# EAGLE design weightScale (EAGLE 9.6.2)
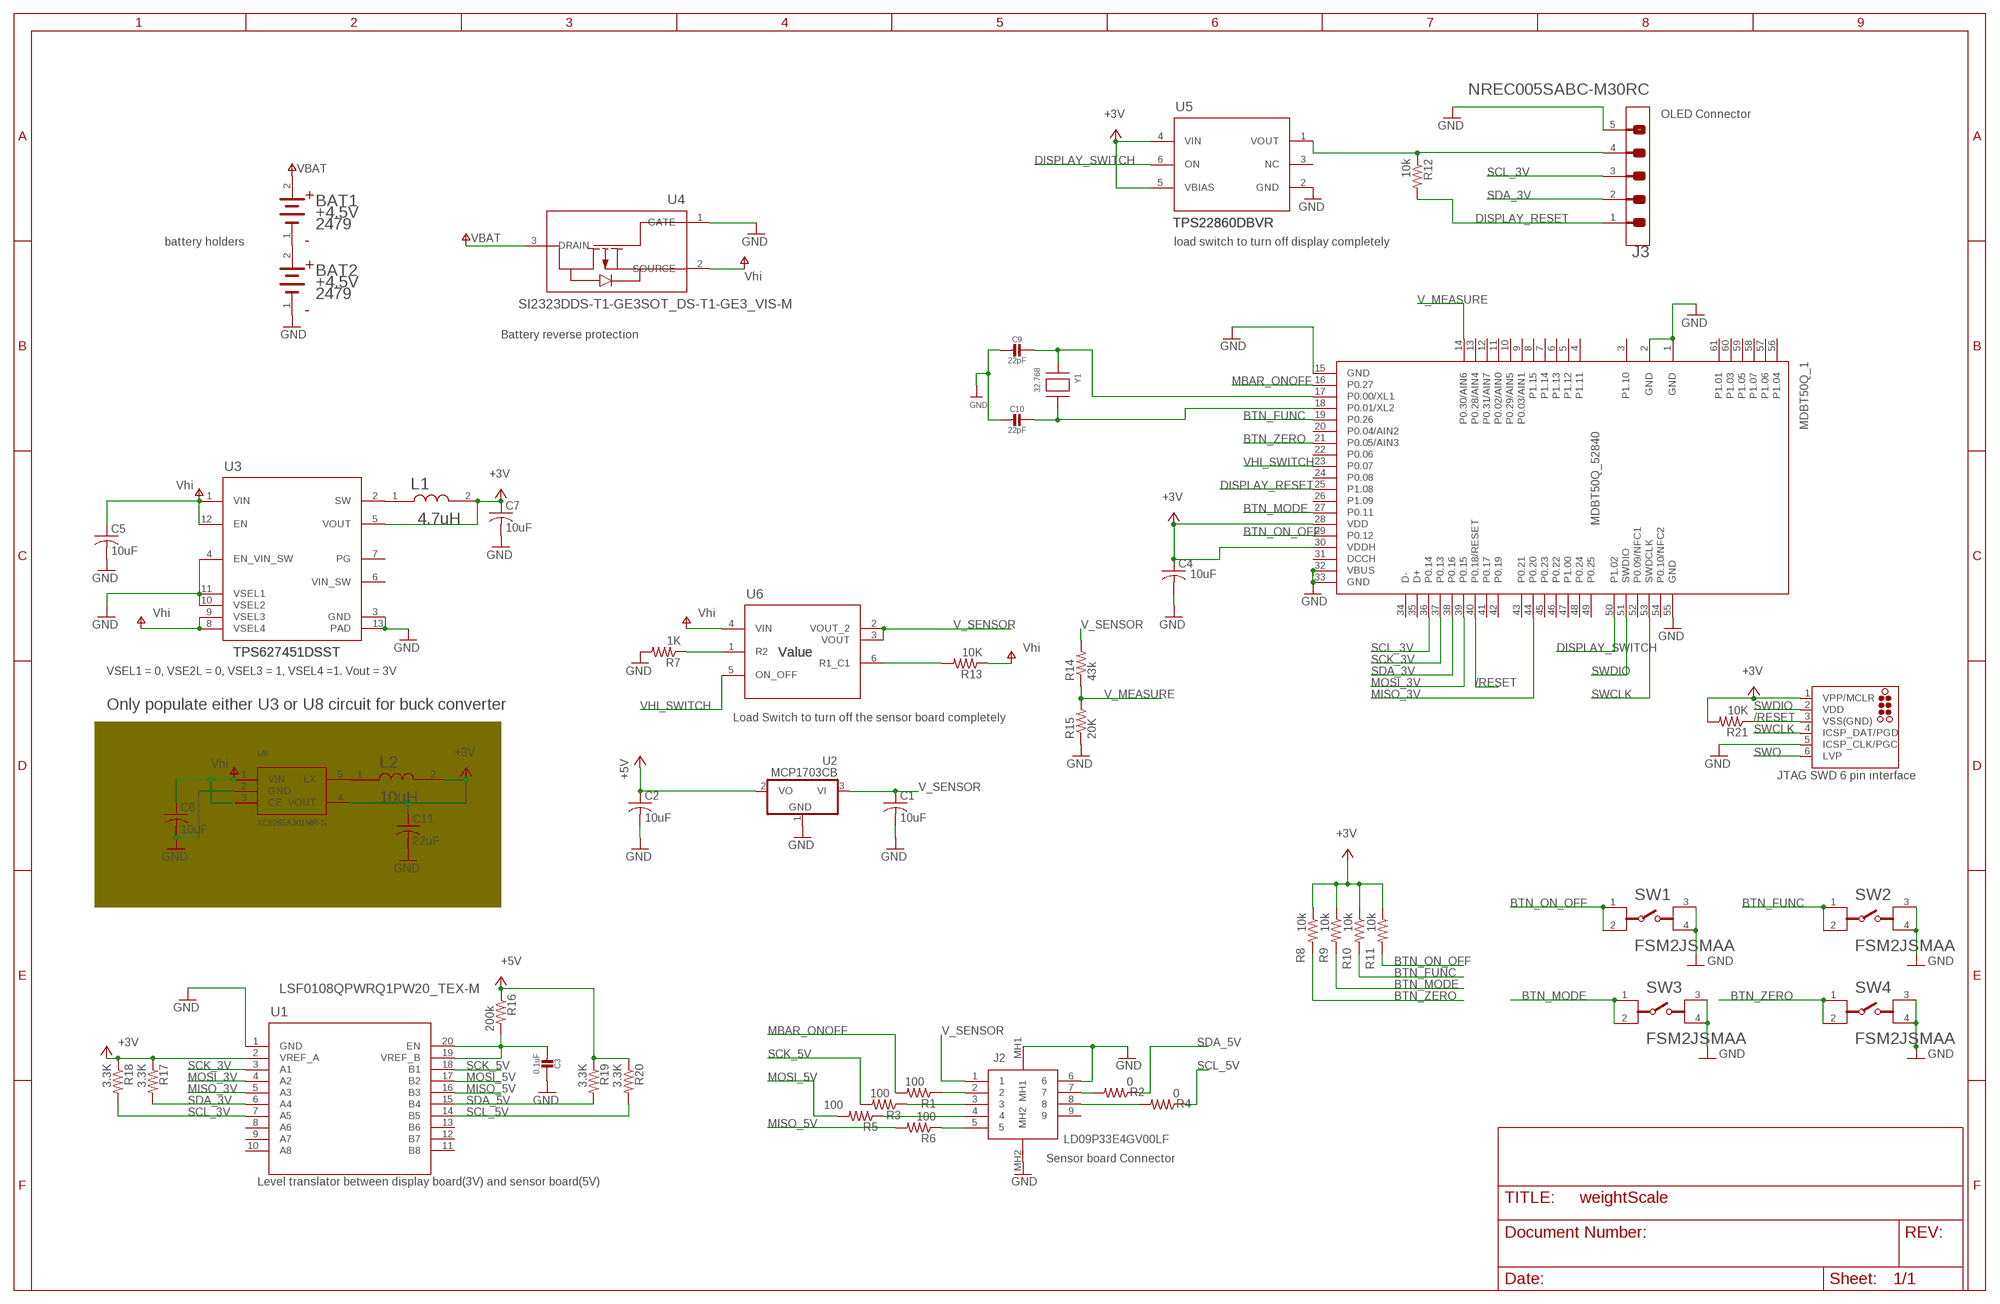
[diagram p0: schematic, sheet 1]

## Parts
BAT1  KEYSTONE_2479KEYSTONE_2479_0_0  [KEYSTONE_2479_0]
BAT2  KEYSTONE_2479KEYSTONE_2479_0_0  [KEYSTONE_2479_0]
C1  10uF  C-USC0805  [C0805]
C2  10uF  C-USC0805  [C0805]
C3  0.1uF  CAP_CERAMIC_0603MP  [_0603MP]
C4  10uF  C-USC1206  [C1206]
C5  10uF  C-USC0805  [C0805]
C6  10uF  C-USC0603K  [C0603K]
C7  10uF  C-USC0805  [C0805]
C9  22pF  CAP_CERAMIC_0603MP  [_0603MP]
C10  22pF  CAP_CERAMIC_0603MP  [_0603MP]
C11  22uF  C-USC0603K  [C0603K]
J2  LD09P33E4GV00LF  [LD09P33E4GV00LF]
J3  SULLINS_NREC005SABC-M30RCSULLINS_NREC005SABC-M30RC_0_0  [SULLINS_NREC005SABC-M30RC_0]
J4  TC2030-MCP-NL  [TC2030-MCP-NL]
L1  MURATA_DFE252010F-4R7M=P2MURATA_DFE252010F-4R7M=P2_0_0  [MURATA_DFE252010F-4R7M=P2_0]
L2  MURATA_1239AS-H-100M=P2MURATA_1239AS-H-100M=P2_0_0  [MURATA_1239AS-H-100M=P2_0]
MDBT50Q_1  MDBT50Q_52840  [MDBT50Q]
R1  100  R-US_R0603  [R0603]
R2  0  R-US_R0603  [R0603]
R3  100  R-US_R0603  [R0603]
R4  0  R-US_R0603  [R0603]
R5  100  R-US_R0603  [R0603]
R6  100  R-US_R0603  [R0603]
R7  1K  R-US_R0603  [R0603]
R8  10k  R-US_R0603  [R0603]
R9  10k  R-US_R0603  [R0603]
R10  10k  R-US_R0603  [R0603]
R11  10k  R-US_R0603  [R0603]
R12  10k  R-US_R0603  [R0603]
R13  10K  R-US_R0603  [R0603]
R14  43k  R-US_R0603  [R0603]
R15  20K  R-US_R0603  [R0603]
R16  200k  R-US_R0603  [R0603]
R17  3.3K  R-US_R0603  [R0603]
R18  3.3K  R-US_R0603  [R0603]
R19  3.3K  R-US_R0603  [R0603]
R20  3.3K  R-US_R0603  [R0603]
R21  10K  R-US_R0603  [R0603]
SW1  TE_CONNECTIVITY_FSM2JSMAATE_CONNECTIVITY_FSM2JSMAA_0_0  [TE_CONNECTIVITY_FSM2JSMAA_0]
SW2  TE_CONNECTIVITY_FSM2JSMAATE_CONNECTIVITY_FSM2JSMAA_0_0  [TE_CONNECTIVITY_FSM2JSMAA_0]
SW3  TE_CONNECTIVITY_FSM2JSMAATE_CONNECTIVITY_FSM2JSMAA_0_0  [TE_CONNECTIVITY_FSM2JSMAA_0]
SW4  TE_CONNECTIVITY_FSM2JSMAATE_CONNECTIVITY_FSM2JSMAA_0_0  [TE_CONNECTIVITY_FSM2JSMAA_0]
U1  LSF0108QPWRQ1PW20_TEX-M  [PW20_TEX-M]
U2  MCP1703CB  [SOT23]
U3  TPS627451DSST  [DSS0012A]
U4  SI2323DDS-T1-GE3SOT_DS-T1-GE3_VIS-M  [SOT_DS-T1-GE3_VIS-M]
U5  TPS22860DBVR  [DBV0006A_N]
U6  Value  TPS27081ADDCR  [DDC0006A_N]
U8  XC9265A301MR-G  [SOT-25]
Y1  32.768  XTAL-3.2X1.5  [XTAL3215]

## Nets
+3V: C4.1 C7.1 C11.1 J4.1(VPP/MCLR) L1.2 L2.2 MDBT50Q_1.28(VDD) MDBT50Q_1.30(VDDH) R8.1 R9.1 R10.1 R11.1 R17.1 R18.1 R21.2 U1.2(VREF_A) U3.5(VOUT) U5.4(VIN) U5.5(VBIAS) U8.4(VOUT)
+5V: C2.1 R16.1 R19.1 R20.1 U2.2(VO)
/RESET: J4.3(VSS(GND)) MDBT50Q_1.40(P0.18/RESET) R21.1
BTN_FUNC: MDBT50Q_1.19(P0.26) R10.2 SW2.1 SW2.2
BTN_MODE: MDBT50Q_1.27(P0.11) R9.2 SW3.1 SW3.2
BTN_ON_OFF: MDBT50Q_1.29(P0.12) R11.2 SW1.1 SW1.2
BTN_ZERO: MDBT50Q_1.21(P0.05/AIN3) R8.2 SW4.1 SW4.2
DISPLAY_RESET: J3.1 MDBT50Q_1.25(P1.08) R12.2
DISPLAY_SWITCH: MDBT50Q_1.50(P1.02) U5.6(ON)
GND: BAT2.1(CATHODE) C1.2 C2.2 C3.1 C4.2 C5.2 C6.2 C7.2 C9.2 C10.2 C11.2 J2.6 J2.MH1 J2.MH2 J3.5 J4.5(ICSP_CLK/PGC) MDBT50Q_1.1(GND) MDBT50Q_1.2(GND) MDBT50Q_1.15(GND) MDBT50Q_1.32(VBUS) MDBT50Q_1.33(GND) MDBT50Q_1.55(GND) R7.2 R15.1 SW1.3 SW1.4 SW2.3 SW2.4 SW3.3 SW3.4 SW4.3 SW4.4 U1.1(GND) U2.1(GND) U3.3(GND) U3.4(EN_VIN_SW) U3.10(VSEL2) U3.11(VSEL1) U3.13(PAD) U4.1(GATE) U5.2(GND) U8.2(GND)
MBAR_ONOFF: MDBT50Q_1.16(P0.27) R1.2
MISO_3V: MDBT50Q_1.44(P0.20) U1.5(A3)
MISO_5V: R6.2 U1.16(B3)
MOSI_3V: MDBT50Q_1.39(P0.15) U1.4(A2)
MOSI_5V: R5.2 U1.17(B2)
N$1: R7.1 U6.1(R2)
N$2: J2.2 R1.1
N$3: R13.2 U6.6(R1_C1)
N$4: J2.3 R3.1
N$5: J2.7 R2.2
N$6: C3.2 R16.2 U1.19(VREF_B) U1.20(EN)
N$7: J2.4 R5.1
N$8: J2.5 R6.1
N$9: C9.1 MDBT50Q_1.17(P0.00/XL1) Y1.P$1
N$10: C10.1 MDBT50Q_1.18(P0.01/XL2) Y1.P$2
N$11: J2.8 R4.2
N$12: J3.4 R12.1 U5.1(VOUT)
N$15: L2.1 U8.5(LX)
N$16: BAT1.1(CATHODE) BAT2.2(ANODE)
N$18: L1.1 U3.2(SW)
SCK_3V: MDBT50Q_1.37(P0.13) U1.3(A1)
SCK_5V: R3.2 U1.18(B1)
SCL_3V: J3.3 MDBT50Q_1.36(P0.14) R18.2 U1.7(A5)
SCL_5V: R4.1 R20.2 U1.14(B5)
SDA_3V: J3.2 MDBT50Q_1.38(P0.16) R17.2 U1.6(A4)
SDA_5V: R2.1 R19.2 U1.15(B4)
SWCLK: J4.4(ICSP_DAT/PGD) MDBT50Q_1.53(SWDCLK)
SWDIO: J4.2(VDD) MDBT50Q_1.51(SWDIO)
SWO: J4.6(LVP)
V+: BAT1.2(ANODE) C5.1 C6.1 R13.1 U3.1(VIN) U3.8(VSEL4) U3.9(VSEL3) U3.12(EN) U4.2(SOURCE) U4.3(DRAIN) U6.4(VIN) U8.1(VIN) U8.3(CE) ; supply symbol labelled Vhi, VBAT
V_MEASURE: MDBT50Q_1.14(P0.30/AIN6) R14.1 R15.2
V_SENSOR: C1.1 J2.1 R14.2 U2.3(VI) U6.2(VOUT_2) U6.3(VOUT)
VHI_SWITCH: MDBT50Q_1.23(P0.07) U6.5(ON_OFF)
Unconnected: J2.9 MDBT50Q_1.3(P1.10) MDBT50Q_1.4(P1.11) MDBT50Q_1.5(P1.12) MDBT50Q_1.6(P1.13) MDBT50Q_1.7(P1.14) MDBT50Q_1.8(P1.15) MDBT50Q_1.9(P0.03/AIN1) MDBT50Q_1.10(P0.29/AIN5) MDBT50Q_1.11(P0.02/AIN0) MDBT50Q_1.12(P0.31/AIN7) MDBT50Q_1.13(P0.28/AIN4) MDBT50Q_1.20(P0.04/AIN2) MDBT50Q_1.22(P0.06) MDBT50Q_1.24(P0.08) MDBT50Q_1.26(P1.09) MDBT50Q_1.31(DCCH) MDBT50Q_1.34(D-) MDBT50Q_1.35(D+) MDBT50Q_1.41(P0.17) MDBT50Q_1.42(P0.19) MDBT50Q_1.43(P0.21) MDBT50Q_1.45(P0.23) MDBT50Q_1.46(P0.22) MDBT50Q_1.47(P1.00) MDBT50Q_1.48(P0.24) MDBT50Q_1.49(P0.25) MDBT50Q_1.52(P0.09/NFC1) MDBT50Q_1.54(P0.10/NFC2) MDBT50Q_1.56(P1.04) MDBT50Q_1.57(P1.06) MDBT50Q_1.58(P1.07) MDBT50Q_1.59(P1.05) MDBT50Q_1.60(P1.03) MDBT50Q_1.61(P1.01) U1.8(A6) U1.9(A7) U1.10(A8) U1.11(B8) U1.12(B7) U1.13(B6) U3.7(PG) U5.3(NC)

## Notes on the sheet
- OLED Connector
- battery holders | load switch to turn off display completely
- Battery reverse protection
- VSEL1 = 0, VSE2L = 0, VSEL3 = 1, VSEL4 =1. Vout = 3V
- Only populate either U3 or U8 circuit for buck converter
- Load Switch to turn off the sensor board completely
- JTAG SWD 6 pin interface
- Sensor board Connector
- Level translator between display board(3V) and sensor board(5V)

## Power pins joined to a net without a drawn wire
VIN_SW: U3.6(VIN_SW)

## Library data of the parts
BAT1 BAT2 = Keystone - 2479:KEYSTONE_2479: PC BATTERY HOLDER (3) 'AAA'; CENTROID_NOT_SPECIFIED: No; DATASHEET: http://www.keyelco.com/product-pdf.cfm?p=1041; DIGIKEY_DESCRIPTION: UNK HOLDER BATTERY 3CELL AAA PC MNT; DIGIKEY_PART_NUMBER: 36-2479-ND; LEAD_FREE: yes; MF: Keystone; MOUNTING_TYPE: PCB, Through Hole; MOUSER_PART_NUMBER: 534-2479; MPN: 2479; PACKAGE: CONN_BAT_HOLDER_3_AAA; PREFIX: BAT; ROHS: yes
C1 C2 C4-C7 C11 = adafruit:C-US: CAPACITOR, American symbol
C3 C9 C10 = microbuilder:CAP_CERAMIC: Ceramic Capacitors For new designs, use the packages preceded by an '_' character since they are more reliable: The following footprints should be used on most boards: _0402 - Standard footprint for regular board layouts _0603 - Standard footprint for regular board layouts _0805 - Standard footprint for regular board layouts _1206 - Standard footprint for regular board layouts For extremely tight-pitch boards where space is at a premium, the following 'micro-pitch' footprints can be used (smaller pads, no silkscreen outline, etc.): _0402MP - Micro-pitch footprint for very dense/compact boards _0603MP - Micro-pitch footprint for very dense/compact boards _0805MP - Micro-pitch footprint for very dense/compact boards _1206MP - Micro-pitch footprint for very dense/compact boards
J2 = SamacSys_Parts:LD09P33E4GV00LF: D-Sub Standard Connectors DSub R/A STB 9 Pin LF Source: Datasheet <https://www.mouser.mx/datasheet/2/18/10130914-1362388.pdf>; ARROW_PART_NUMBER: LD09P33E4GV00LF; ARROW_PRICE-STOCK: https://www.arrow.com/en/products/ld09p33e4gv00lf/amphenol-fci; DESCRIPTION: D-Sub Standard Connectors DSub R/A STB 9 Pin LF; HEIGHT: 12.96mm; MANUFACTURER_NAME: Amphenol; MANUFACTURER_PART_NUMBER: LD09P33E4GV00LF; MOUSER_PART_NUMBER: 649-LD09P33E4GV00LF; MOUSER_PRICE-STOCK: https://www.mouser.co.uk/ProductDetail/Amphenol-FCI/LD09P33E4GV00LF?qs=tZOhSuJQg1nNyHdnl62Ffg%3D%3D
J3 = Sullins - NREC005SABC-M30RC:SULLINS_NREC005SABC-M30RC: HEADER MALE .100"[2.54mm]PITCH, SM; CENTROID_NOT_SPECIFIED: No; DATASHEET: http://media.digikey.com/PDF/Data%20Sheets/Sullins%20PDFs/xRxCzzzSzzz-M30RC_11657-B.pdf; DIGIKEY_DESCRIPTION: CONN S1013EC-05-ND; DIGIKEY_PART_NUMBER: CONN HEADER .100" SNGL SMD 5POS; LEAD_FREE: yes; MF: Sullins; MPN: NREC005SABC-M30RC; PACKAGE: HDR5; PREFIX: J; ROHS: yes; TEMPERATURE_RANGE_HIGH: +105°C; TEMPERATURE_RANGE_LOW: -40°C
J4 = tag-connect:TC2030: TAG-CONNECT ICSP Connector Manufacturer: Tag-Connect <http://www.tag-connect.com> Cable for easy In-Circuit Serial Programming. Designed for Microchip ICD2, suitable for many others. Two variants - one "with legs" (for hands-free fit on PCB) and another "without legs" for quick programming. PAD Description 1 MCLR/Vpp 2 Vdd 3 GND 4 PGD (ISPDAT) 5 PGC (ISPCLK) 6 nc (used for LVP) ©2009 ROFA.cz - modified and updated by Robert Darlington ‹rdarlington@gmail.com›
L1 = Murata - DFE252010F-4R7M=P2:MURATA_DFE252010F-4R7M=P2: Shielded Wirewound Inductor 4.7uH 1400mA 0.24Ω 1008 (2520); AUTOMOTIVE: No; CENTROID_NOT_SPECIFIED: No; COMPOSITION: Wirewound; CORE_MATERIAL: Metal Alloy; DATASHEET: https://www.murata.com/en-us/products/productdetail?partno=DFE252010F-4R7M%23; DEVICE_CLASS_L1: Passive Components; DEVICE_CLASS_L2: Inductors; DEVICE_CLASS_L3: Fixed Inductors; FOOTPRINT_PARAMETERS_1: {"fp_type":"chip_res","params":{"L":{"nom":2500000,"long name":"Length","min":2300000,"max":2700000,"short name":"L","type":"measurement"},"W":{"nom":2000000,"long name":"Width","min":1800000,"max":2200000,"short name":"W","type":"measurement"},"t":{"nom":false,"long name":"Height","min":false,"max":1000000,"short name":"t","type":"measurement"},"b":{"nom":600000,"long name":"Terminal width","min":399999,"max":800000,"short name":"b","type":"measurement"},"P":{"default":"false","long name":"Polarized","type":"multichoice","short name":"P"},"offset x":{"nom":0,"long name":"X Center offset","min":null,"max":null,"short name":"offset x","type":"measurement"},"offset y":{"nom":0,"long name":"Y Center offset","min":null,"max":null,"short name":"offset y","type":"measurement"},"LS":{"long name":"Land shape","type":"fixed","short name":"LS","value":"Rectangle"},"solder toe":{"nom":550000,"long name":"Solder fillet (toe)","min":null,"max":null,"short name":"solder toe","type":"fixedmeasurement"},"solder heel":{"nom":0,"long name":"Solder fillet (heel)","min":null,"max":null,"short name":"solder heel","type":"fixedmeasurement"},"solder side":{"nom":50000,"long name":"Solder fillet (side)","min":null,"max":null,"short name":"solder side","type":"fixedmeasurement"},"courtyard":{"nom":500000,"long name":"Courtyard","min":null,"max":null,"short name":"courtyard","type":"fixedmeasurement"},"SF":{"default":"A (>= 1608 metric)","long name":"Packing level","type":"multichoiceparent","short name":"SF","help":"http://support.upverter.com/customer/portal/articles/978783-what-is-a-footprint-packing-level","children":["solder toe","solder heel","solder side","courtyard"]}}}; FOOTPRINT_PARAMETERS_2: {"fp_type":"chip_res","params":{"L":{"nom":2500000,"long name":"Length","min":2300000,"max":2700000,"short name":"L","type":"measurement"},"W":{"nom":2000000,"long name":"Width","min":1800000,"max":2200000,"short name":"W","type":"measurement"},"t":{"nom":false,"long name":"Height","min":false,"max":1000000,"short name":"t","type":"measurement"},"b":{"nom":600000,"long name":"Terminal width","min":399999,"max":800000,"short name":"b","type":"measurement"},"P":{"default":"false","long name":"Polarized","type":"multichoice","short name":"P"},"offset x":{"nom":0,"long name":"X Center offset","min":null,"max":null,"short name":"offset x","type":"measurement"},"offset y":{"nom":0,"long name":"Y Center offset","min":null,"max":null,"short name":"offset y","type":"measurement"},"LS":{"long name":"Land shape","type":"fixed","short name":"LS","value":"Rectangle"},"solder toe":{"nom":350000,"long name":"Solder fillet (toe)","min":null,"max":null,"short name":"solder toe","type":"fixedmeasurement"},"solder heel":{"nom":0,"long name":"Solder fillet (heel)","min":null,"max":null,"short name":"solder heel","type":"fixedmeasurement"},"solder side":{"nom":0,"long name":"Solder fillet (side)","min":null,"max":null,"short name":"solder side","type":"fixedmeasurement"},"courtyard":{"nom":250000,"long name":"Courtyard","min":null,"max":null,"short name":"courtyard","type":"fixedmeasurement"},"SF":{"default":"B (>= 1608 metric)","long name":"Packing level","type":"multichoiceparent","short name":"SF","help":"http://support.upverter.com/customer/portal/articles/978783-what-is-a-footprint-packing-level","children":["solder toe","solder heel","solder side","courtyard"]}}}; FOOTPRINT_PARAMETERS_3: {"fp_type":"chip_res","params":{"L":{"nom":2500000,"long name":"Length","min":2300000,"max":2700000,"short name":"L","type":"measurement"},"W":{"nom":2000000,"long name":"Width","min":1800000,"max":2200000,"short name":"W","type":"measurement"},"t":{"nom":false,"long name":"Height","min":false,"max":1000000,"short name":"t","type":"measurement"},"b":{"nom":600000,"long name":"Terminal width","min":399999,"max":800000,"short name":"b","type":"measurement"},"P":{"default":"false","long name":"Polarized","type":"multichoice","short name":"P"},"offset x":{"nom":0,"long name":"X Center offset","min":null,"max":null,"short name":"offset x","type":"measurement"},"offset y":{"nom":0,"long name":"Y Center offset","min":null,"max":null,"short name":"offset y","type":"measurement"},"LS":{"long name":"Land shape","type":"fixed","short name":"LS","value":"Rectangle"},"solder toe":{"nom":150000,"long name":"Solder fillet (toe)","min":null,"max":null,"short name":"solder toe","type":"fixedmeasurement"},"solder heel":{"nom":0,"long name":"Solder fillet (heel)","min":null,"max":null,"short name":"solder heel","type":"fixedmeasurement"},"solder side":{"nom":-50000,"long name":"Solder fillet (side)","min":null,"max":null,"short name":"solder side","type":"fixedmeasurement"},"courtyard":{"nom":100000,"long name":"Courtyard","min":null,"max":null,"short name":"courtyard","type":"fixedmeasurement"},"SF":{"default":"C (>= 1608 metric)","long name":"Packing level","type":"multichoiceparent","short name":"SF","help":"http://support.upverter.com/customer/portal/articles/978783-what-is-a-footprint-packing-level","children":["solder toe","solder heel","solder side","courtyard"]}}}; FOOTPRINT_VARIANT_NAME_0: Recommended_Land_Pattern; FOOTPRINT_VARIANT_NAME_1: IPC_A; FOOTPRINT_VARIANT_NAME_2: IPC_B; FOOTPRINT_VARIANT_NAME_3: IPC_C; HEIGHT: 1mm; INDUCTANCE: 4.7uH; IPC_LAND_PATTERN_NAME: CAPC250200X100; LEAD_FREE: Yes; MF: Murata; MFG_PACKAGE_IDENT: DFE252010C; MFG_PACKAGE_IDENT_COMPONENT_ID: f176bbc934fc0607; MFG_PACKAGE_IDENT_DATE: 0; MFG_PACKAGE_IDENT_REV: 0; MPN: DFE252010F-4R7M=P2; PACKAGE: 1008 (2520); PREFIX: L; RMS_CURRENT: 1400mA; ROHS: Yes; SATURATION_CURRENT: 1900mA; SERIES_RESISTANCE: 0.24Ω; SHIELDING: true; TEMPERATURE_RANGE_HIGH: +125°C; TEMPERATURE_RANGE_LOW: -40°C; TEST_FREQUENCY: 1MHz; TOLERANCE: 0.2; VERIFICATION_VERSION: 0.0.0.3
L2 = Murata - 1239AS-H-100M=P2:MURATA_1239AS-H-100M=P2: Shielded Wirewound Inductor 10uH 20% 850mA 0.46Ω 1008 (2520); AUTOMOTIVE: No; CENTROID_NOT_SPECIFIED: No; COMPOSITION: Wirewound; CORE_MATERIAL: Metal Alloy; DATASHEET: https://www.murata.com/en-us/products/productdetail?partno=1239AS-H-100M%23; DEVICE_CLASS_L1: Passive Components; DEVICE_CLASS_L2: Inductors; DEVICE_CLASS_L3: Fixed Inductors; DIGIKEY_DESCRIPTION: FIXED IND 10UH 1A 460 MOHM SMD; DIGIKEY_PART_NUMBER: 490-10563-1-ND; FOOTPRINT_PARAMETERS_1: {"fp_type":"chip_cap","params":{"L":{"nom":2500000,"long name":"Length","min":2300000,"max":2700000,"short name":"L","type":"measurement"},"W":{"nom":2000000,"long name":"Width","min":1800000,"max":2200000,"short name":"W","type":"measurement"},"t":{"nom":false,"long name":"Height","min":false,"max":1200000,"short name":"t","type":"measurement"},"b":{"nom":600000,"long name":"Terminal width","min":400000,"max":800000,"short name":"b","type":"measurement"},"P":{"default":"false","long name":"Polarized","type":"multichoice","short name":"P"},"offset x":{"nom":0,"long name":"X Center offset","min":null,"max":null,"short name":"offset x","type":"measurement"},"offset y":{"nom":0,"long name":"Y Center offset","min":null,"max":null,"short name":"offset y","type":"measurement"},"POL":{"default":"No","long name":"Pin 1 polarity marker","type":"multichoice","short name":"POL"},"LS":{"long name":"Land shape","type":"fixed","short name":"LS","value":"Rectangle"},"solder toe":{"nom":550000,"long name":"Solder fillet (toe)","min":null,"max":null,"short name":"solder toe","type":"fixedmeasurement"},"solder heel":{"nom":0,"long name":"Solder fillet (heel)","min":null,"max":null,"short name":"solder heel","type":"fixedmeasurement"},"solder side":{"nom":50000,"long name":"Solder fillet (side)","min":null,"max":null,"short name":"solder side","type":"fixedmeasurement"},"courtyard":{"nom":500000,"long name":"Courtyard","min":null,"max":null,"short name":"courtyard","type":"fixedmeasurement"},"SF":{"default":"A (>= 1608 metric)","long name":"Packing level","type":"multichoiceparent","short name":"SF","help":"http://support.upverter.com/customer/portal/articles/978783-what-is-a-footprint-packing-level","children":["solder toe","solder heel","solder side","courtyard"]}}}; FOOTPRINT_PARAMETERS_2: {"fp_type":"chip_cap","params":{"L":{"nom":2500000,"long name":"Length","min":2300000,"max":2700000,"short name":"L","type":"measurement"},"W":{"nom":2000000,"long name":"Width","min":1800000,"max":2200000,"short name":"W","type":"measurement"},"t":{"nom":false,"long name":"Height","min":false,"max":1200000,"short name":"t","type":"measurement"},"b":{"nom":600000,"long name":"Terminal width","min":400000,"max":800000,"short name":"b","type":"measurement"},"P":{"default":"false","long name":"Polarized","type":"multichoice","short name":"P"},"offset x":{"nom":0,"long name":"X Center offset","min":null,"max":null,"short name":"offset x","type":"measurement"},"offset y":{"nom":0,"long name":"Y Center offset","min":null,"max":null,"short name":"offset y","type":"measurement"},"POL":{"default":"No","long name":"Pin 1 polarity marker","type":"multichoice","short name":"POL"},"LS":{"long name":"Land shape","type":"fixed","short name":"LS","value":"Rectangle"},"solder toe":{"nom":350000,"long name":"Solder fillet (toe)","min":null,"max":null,"short name":"solder toe","type":"fixedmeasurement"},"solder heel":{"nom":0,"long name":"Solder fillet (heel)","min":null,"max":null,"short name":"solder heel","type":"fixedmeasurement"},"solder side":{"nom":0,"long name":"Solder fillet (side)","min":null,"max":null,"short name":"solder side","type":"fixedmeasurement"},"courtyard":{"nom":250000,"long name":"Courtyard","min":null,"max":null,"short name":"courtyard","type":"fixedmeasurement"},"SF":{"default":"B (>= 1608 metric)","long name":"Packing level","type":"multichoiceparent","short name":"SF","help":"http://support.upverter.com/customer/portal/articles/978783-what-is-a-footprint-packing-level","children":["solder toe","solder heel","solder side","courtyard"]}}}; FOOTPRINT_PARAMETERS_3: {"fp_type":"chip_cap","params":{"L":{"nom":2500000,"long name":"Length","min":2300000,"max":2700000,"short name":"L","type":"measurement"},"W":{"nom":2000000,"long name":"Width","min":1800000,"max":2200000,"short name":"W","type":"measurement"},"t":{"nom":false,"long name":"Height","min":false,"max":1200000,"short name":"t","type":"measurement"},"b":{"nom":600000,"long name":"Terminal width","min":400000,"max":800000,"short name":"b","type":"measurement"},"P":{"default":"false","long name":"Polarized","type":"multichoice","short name":"P"},"offset x":{"nom":0,"long name":"X Center offset","min":null,"max":null,"short name":"offset x","type":"measurement"},"offset y":{"nom":0,"long name":"Y Center offset","min":null,"max":null,"short name":"offset y","type":"measurement"},"POL":{"default":"No","long name":"Pin 1 polarity marker","type":"multichoice","short name":"POL"},"LS":{"long name":"Land shape","type":"fixed","short name":"LS","value":"Rectangle"},"solder toe":{"nom":150000,"long name":"Solder fillet (toe)","min":null,"max":null,"short name":"solder toe","type":"fixedmeasurement"},"solder heel":{"nom":0,"long name":"Solder fillet (heel)","min":null,"max":null,"short name":"solder heel","type":"fixedmeasurement"},"solder side":{"nom":-50000,"long name":"Solder fillet (side)","min":null,"max":null,"short name":"solder side","type":"fixedmeasurement"},"courtyard":{"nom":100000,"long name":"Courtyard","min":null,"max":null,"short name":"courtyard","type":"fixedmeasurement"},"SF":{"default":"C (>= 1608 metric)","long name":"Packing level","type":"multichoiceparent","short name":"SF","help":"http://support.upverter.com/customer/portal/articles/978783-what-is-a-footprint-packing-level","children":["solder toe","solder heel","solder side","courtyard"]}}}; FOOTPRINT_VARIANT_NAME_0: Recommended_Land_Pattern; FOOTPRINT_VARIANT_NAME_1: IPC_A; FOOTPRINT_VARIANT_NAME_2: IPC_B; FOOTPRINT_VARIANT_NAME_3: IPC_C; HEIGHT: 1.2mm; INDUCTANCE: 10uH; IPC_LAND_PATTERN_NAME: CAPC250200X120; LEAD_FREE: Yes; MF: Murata; MFG_PACKAGE_IDENT: DFE252012C; MFG_PACKAGE_IDENT_COMPONENT_ID: bc933d2e2fe95b90; MFG_PACKAGE_IDENT_DATE: 0; MFG_PACKAGE_IDENT_REV: 0; MOUSER_DESCRIPTION: Inductor Power Shielded Multi-Layer 10uH 20% 1MHz Metal 850mA 460mOhm DCR 1008 T/R; MOUSER_PART_NUMBER: 81-1239AS-H-100MP2; MPN: 1239AS-H-100M=P2; PACKAGE: 1008 (2520); PREFIX: L; RMS_CURRENT: 850mA; ROHS: Yes; SATURATION_CURRENT: 1000mA; SERIES_RESISTANCE: 0.46Ω; SHIELDING: true; TEMPERATURE_RANGE_HIGH: +85°C; TEMPERATURE_RANGE_LOW: -40°C; TEST_FREQUENCY: 1MHz; TOLERANCE: 20%; VERIFICATION_VERSION: 0.0.0.3
MDBT50Q_1 = MDBT50Q_52840_210702:MDBT50Q_52840: Raytac Corporation Part Number: MDBT50Q-1MV2 / MDBT50Q-P1MV2 / MDBT50Q-U1MV2 Bluetooth Low Energy Module based on Noridc nRF52840 Size: 15.5x10.5mm Source: Raytac datasheet
R1-R21 = adafruit:R-US_: RESISTOR, American symbol
SW1-SW4 = TE Connectivity - FSM2JSMAA:TE_CONNECTIVITY_FSM2JSMAA: SWITCH TACTILE SPST-NO 0.05A 24V; AUTOMOTIVE: No; CENTROID_NOT_SPECIFIED: No; CONTACT_CURRENT_RATING: 50mA; CONTACT_RESISTANCE: 100mΩ; DATASHEET: https://www.te.com/commerce/DocumentDelivery/DDEController?Action=showdoc&DocId=Customer+Drawing%7F2-1437565-7%7FV%7Fpdf%7FEnglish%7FENG_CD_2-1437565-7_V.pdf%7F2-1437565-8; DEVICE_CLASS_L1: Electromechanical; DEVICE_CLASS_L2: Switches; DEVICE_CLASS_L3: Pushbutton Switches; DIGIKEY_DESCRIPTION: SWITCH TACTILE SPST-NO 0.05A 24V; DIGIKEY_PART_NUMBER: 450-3355-ND; ELECTROMECHANICAL_LIFE: 100000Cycles; FOOTPRINT_VARIANT_NAME_0: Recommended_Land_Pattern; HEIGHT: 4.59mm; LEAD_FREE: Yes; MF: TE Connectivity; MFG_PACKAGE_IDENT: 0; MFG_PACKAGE_IDENT_DATE: 0; MFG_PACKAGE_IDENT_REV: 0; MOUNT: Surface Mount; MOUSER_DESCRIPTION: Tactile Switches TACTILE 260G FORCE S; MOUSER_PART_NUMBER: 506-2-1437565-8; MPN: FSM2JSMAA; OPERATING_FORCE: 260gf; PACKAGE: SMT_SW_6MM00_6MM00; PREFIX: SW; ROHS: Yes; STANDOFF_HEIGHT: 0.05mm; TEMPERATURE_RANGE_HIGH: +85°C; TEMPERATURE_RANGE_LOW: -35°C; THROW_CONFIGURATION: SPST-NO; VERIFICATION_VERSION: 0.0.0.3; VOLTAGE_RATING_DC: 24V
U1 = LSF0108:LSF0108QPWRQ1; COPYRIGHT: Copyright (C) 2021 Ultra Librarian. All rights reserved.; MANUFACTURER_PART_NUMBER: LSF0108QPWRQ1; MFR_NAME: Texas Instruments
U2 = linear:MCP1703: 250 mA, 16V, Low Quiescent Current LDO Regulator Source: http://ww1.microchip.com/downloads/en/DeviceDoc/22049b.pdf
U3 = weightScale:TPS627451DSST; COPYRIGHT: Copyright (C) 2021 Ultra Librarian. All rights reserved.; MANUFACTURER_PART_NUMBER: TPS627451DSST; MFR_NAME: Texas Instruments; REFDES: RefDes; TYPE: TYPE
U4 = weightScale:SI2323DDS-T1-GE3; COPYRIGHT: Copyright (C) 2021 Ultra Librarian. All rights reserved.; MANUFACTURER_PART_NUMBER: SI2323DDS-T1-GE3; MFR_NAME: Vishay
U5 = weightScale:TPS22860DBVR; COPYRIGHT: Copyright (C) 2021 Ultra Librarian. All rights reserved.; MANUFACTURER_PART_NUMBER: TPS22860DBVR; MFR_NAME: Texas Instruments; REFDES: RefDes; TYPE: TYPE
U6 = weightScale:TPS27081ADDCR; APPLICATION_BUILDNUMBER: *; COMPTYPE: IC; MANUFACTURER: Texas Instruments; MOUNTTYPE: SMT; PACKAGEREFERENCE: DDC0006A; PARTNUMBER: TPS27081ADDCR; PIN_COUNT: 6; REFDES: RefDes; ROHS: Y; TYPE: TYPE
U8 = weightScale:XC9265A301MR-G: XC9265 series are Ultra Low Power synchronous-rectification type PFM step down DC/DC converters with a built-in 0.4Ω (TYP.) Pch driver and 0.4Ω (TYP.) Nch synchronous switching transistor, designed to allow the use of ceramic capacitor. PFM control enables a low quiescent current, making these products ideal for battery operated devices that require high efficiency and long battery life. Only inductor, CIN and CL capacitors are needed as external parts to make a step down DC/DC circuit. Operation voltage range is from 2.0V to 6.0V. This product has fixed output voltage from 1.0V to 4.0V(accuracy: ±2.0%) in increments of 0.05V.
Y1 = adafruit2:XTAL: Low cost SMT crystals, no capacitors included http://www.ladyada.net/library/eagle

## Board
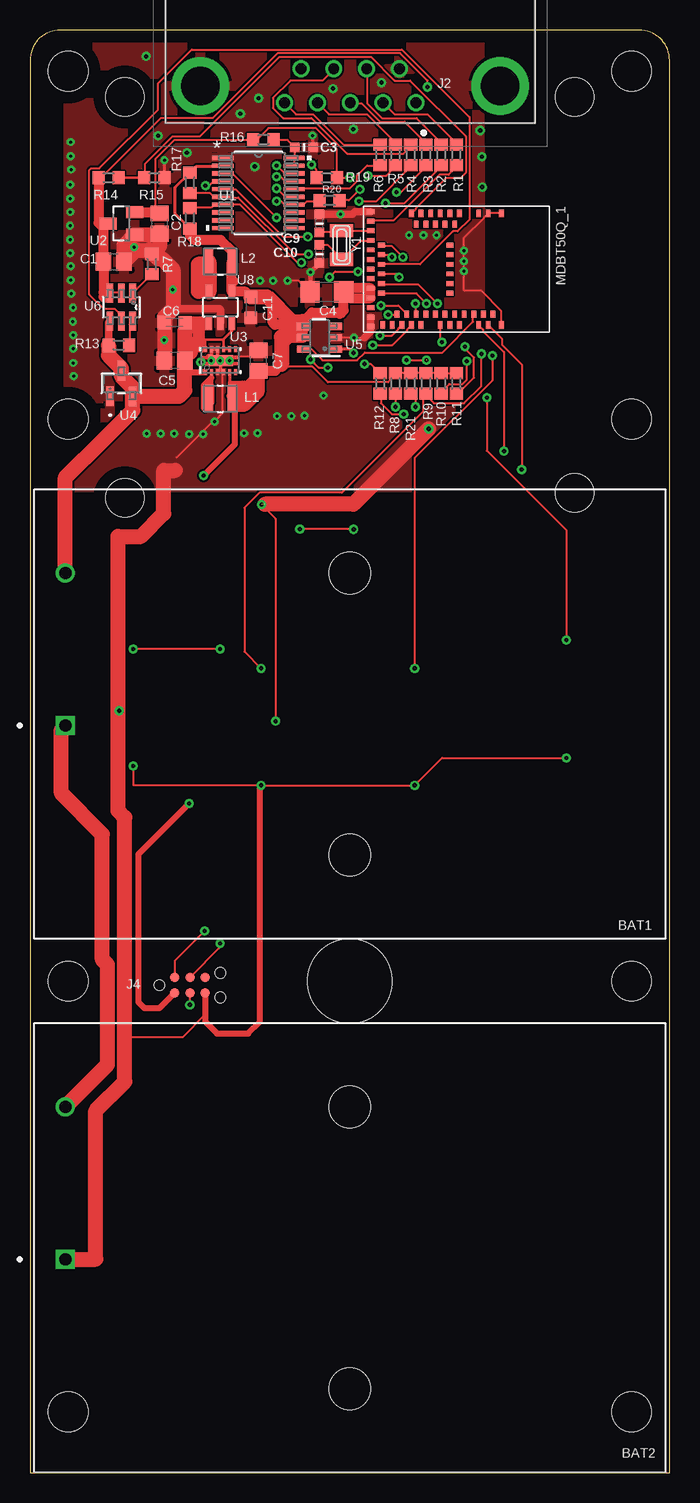
[diagram p1: board, top side]
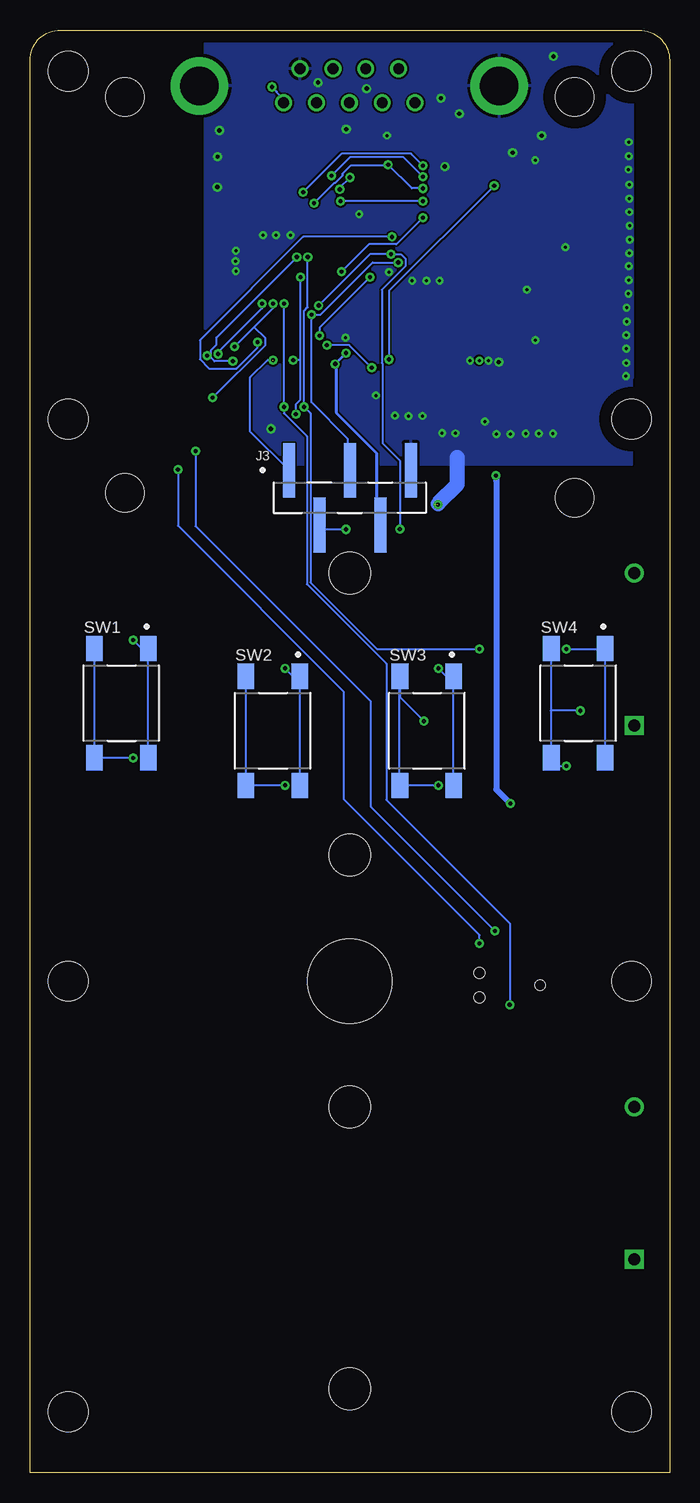
[diagram p2: board, bottom side, seen from below]

Size 53.34 x 120.27 mm. Coordinates in mm from the lower left corner, seen from the top.
Outline: 0,0 53.34,0 53.34,117.73 arc90 50.8,120.27 2.54,120.27 arc90 0,117.73 0,0
Copper layers (1*16): Top 0.035mm / dielectric 1.5mm / Bottom 0.035mm
Design rules "default": minimum track width 6mil, minimum drill 0.35mm, track to track 6mil, track to pad 6mil, pad to pad 6mil, via to via 6mil, smd to smd 6mil, copper to edge 40mil, drill to drill 6mil, minimum pad ring 10mil, minimum via ring 8mil, stop-mask expansion 4mil, vias tented up to drill 0mil, thermal gap 10mil
Holes 3.3 mm at 3.17,5.08 50.16,5.08 3.17,40.97 50.16,40.97 3.17,87.83 50.16,87.83 50.16,116.84 3.17,116.84
Holes 3.17 mm at 7.92,114.68 7.92,81.28 45.42,114.68 45.42,81.69
Holes 7.01 mm at 26.67,40.97

### Footprints (pad centres in the part's own frame; a part is rotated, then mirrored left to right if it is on the bottom)
KEYSTONE_2479_0 = drill 1.02 pad 1.57 square: 1 23.72,0.95 | drill 1.02 pad 1.57: 2 23.72,-11.75 | hole 3.45: 0,11.75; 0,-11.75
C0805 = smd 1.3 x 1.5: 1 -0.85,0; 2 0.85,0
_0603MP = smd 0.8 x 0.8: 1 -0.762,0; 2 0.762,0
C1206 = smd 1.6 x 1.8: 1 -1.4,0; 2 1.4,0
C0603K = smd 1.05 x 1.08: 1 -0.875,0; 2 0.875,0
LD09P33E4GV00LF = drill 0.9 pad 1.4: 1 0,0; 2 2.74,0; 3 5.48,0; 4 8.22,0; 5 10.96,0; 6 1.37,-2.84; 7 4.11,-2.84; 8 6.85,-2.84; 9 9.59,-2.84 | drill 3.2 pad 4.8: MH1 -7.015,-1.42; MH2 17.975,-1.42
SULLINS_NREC005SABC-M30RC_0 = smd 1 x 4.565: 1 -5.08,2.282; 2 -2.54,-2.282; 3 0,2.282; 4 2.54,-2.282; 5 5.08,2.282
TC2030-MCP-NL = smd 0.787 x 0.787: 1 1.27,-0.635; 2 1.27,0.635; 3 2.54,-0.635; 4 2.54,0.635; 5 3.81,-0.635; 6 3.81,0.635 | hole 0.889: 0,0; 5.08,-1.016; 5.08,1.016
MURATA_DFE252010F-4R7M=P2_0 = smd 0.8 x 2: 1 -1,0; 2 1,0
MURATA_1239AS-H-100M=P2_0 = smd 0.8 x 2: 1 -1,0; 2 1,0
MDBT50Q = smd 0.6 x 0.4: 1 -4.65,3.75; 2 -4.65,2.65; 3 -4.65,1.85; 4 -4.65,0.25; 5 -3.75,-0.15; 6 -4.65,-0.55; 7 -3.75,-0.95; 8 -4.65,-1.35; 9 -3.75,-1.75; 10 -4.65,-2.15; 11 -3.75,-2.55; 12 -4.65,-2.95; 13 -3.75,-3.35; 14 -4.65,-3.75; 34 4.65,-6.15; 35 4.65,-5.35; 36 3.75,-4.95; 37 4.65,-4.55; 38 3.75,-4.15; 39 4.65,-3.75; 40 3.75,-3.35; 41 4.65,-2.95; 42 3.75,-2.55; 43 3.75,-1.75; 44 4.65,-1.35; 45 3.75,-0.95; 46 4.65,-0.55; 47 3.75,-0.15; 48 4.65,0.25; 49 3.75,0.65; 50 3.75,1.45; 51 4.65,1.85; 52 3.75,2.25; 53 4.65,2.65; 54 3.75,3.05; 55 4.65,3.75 | smd 0.4 x 0.6: 15 -4.8,-7.15; 16 -4,-7.15; 17 -3.2,-7.15; 18 -2.4,-7.15; 19 -2,-6.25; 20 -1.6,-7.15; 21 -1.2,-6.25; 22 -0.8,-7.15; 23 -0.4,-6.25; 24 0,-7.15; 25 0.4,-6.25; 26 0.8,-7.15; 27 1.2,-6.25; 28 1.6,-7.15; 29 2,-6.25; 30 2.4,-7.15; 31 3.2,-7.15; 32 4,-7.15; 33 4.8,-7.15; 56 -2,-0.55; 57 -1.2,-0.55; 58 -0.4,-0.55; 59 0.4,-0.55; 60 1.2,-0.55; 61 2,-0.55
R0603 = smd 1 x 1.1: 1 -0.85,0; 2 0.85,0
TE_CONNECTIVITY_FSM2JSMAA_0 = smd 1.38 x 2.1: 1 2.25,4.55; 2 2.24,-4.55; 3 -2.24,4.55; 4 -2.24,-4.55
PW20_TEX-M = smd 1.778 x 0.356: 1 -2.972,2.925; 2 -2.972,2.275; 3 -2.972,1.625; 4 -2.972,0.975; 5 -2.972,0.325; 6 -2.972,-0.325; 7 -2.972,-0.975; 8 -2.972,-1.625; 9 -2.972,-2.275; 10 -2.972,-2.925; 11 2.972,-2.925; 12 2.972,-2.275; 13 2.972,-1.625; 14 2.972,-0.975; 15 2.972,-0.325; 16 2.972,0.325; 17 2.972,0.975; 18 2.972,1.625; 19 2.972,2.275; 20 2.972,2.925
SOT23 = smd 1 x 1.4: 1 -0.95,-1.1; 2 0.95,-1.1; 3 0,1.1
DSS0012A = smd 0.5 x 0.25: 1 -0.95,1.25; 2 -0.95,0.75; 3 -0.95,0.25; 4 -0.95,-0.25; 5 -0.95,-0.75; 6 -0.95,-1.25; 7 0.95,-1.25; 8 0.95,-0.75; 9 0.95,-0.25; 10 0.95,0.25; 11 0.95,0.75; 12 0.95,1.25 | smd 0.9 x 2: 13 0,0 | smd 0.5 x 0.5: V 0,0.75; V_ 0,-0.75; V__ 0,0
SOT_DS-T1-GE3_VIS-M = smd 0.61 x 1.626: 1 -0.95,-1.067; 2 0.95,-1.067; 3 0,1.067
DBV0006A_N = smd 1 x 0.6: 1 -1.375,0.95; 2 -1.375,0; 3 -1.375,-0.95; 4 1.375,-0.95; 5 1.375,0; 6 1.375,0.95
DDC0006A_N = smd 1.575 x 0.559: 1 -1.168,0.95; 2 -1.168,0; 3 -1.168,-0.95; 4 1.168,-0.95; 5 1.168,0; 6 1.168,0.95
SOT-25 = smd 0.55 x 1.2: 1 -0.95,-1.3; 2 0,-1.3; 3 0.95,-1.3; 4 0.95,1.3; 5 -0.95,1.3
XTAL3215 = smd 1.1 x 1.9: P$1 1.2,0; P$2 -1.2,0

### Placement (x,y rotation side)
BAT1  26.67,63.25 180 top
BAT2  26.67,18.75 180 top
C1  6.99,100.97 0 top
C2  10.79,104.14 270 top
C3  22.86,110.49 180 top
C4  24.77,98.42 180 top
C5  12.06,92.71 180 top
C6  12.06,95.89 180 top
C7  19.05,92.71 90 top
C9  24.13,104.14 90 top
C10  24.13,101.6 270 top
C11  18.41,97.16 270 top
J2  32.19,114.2 180 top
J3  26.67,81.28 0 bottom
J4  10.79,40.64 0 top
L1  15.88,89.53 0 top
L2  15.88,100.97 0 top
MDBT50Q_1  35.56,100.33 270 top
R1  35.56,109.86 270 top
R2  34.29,109.86 90 top
R3  33.02,109.86 270 top
R4  31.75,109.86 90 top
R5  30.48,109.86 270 top
R6  29.21,109.86 270 top
R7  10.16,100.75 90 top
R8  30.48,90.81 270 top
R9  33.02,90.81 270 top
R10  34.29,90.81 270 top
R11  35.56,90.81 270 top
R12  29.21,90.81 270 top
R13  7.41,93.98 0 top
R14  6.57,107.95 180 top
R15  10.38,107.95 180 top
R16  19.47,111.12 0 top
R17  13.34,107.53 270 top
R18  13.34,104.56 90 top
R19  24.77,107.95 180 top
R20  24.98,106.05 180 top
R21  31.75,90.81 90 top
SW1  45.72,64.16 0 bottom
SW2  33.1,61.85 0 bottom
SW3  20.24,61.85 0 bottom
SW4  7.62,64.16 0 bottom
U1  19.05,106.68 0 top
U2  7.62,104.14 90 top
U3  15.88,92.71 90 top
U4  7.62,90.81 0 top
U5  24.13,94.61 180 top
U6  7.62,97.16 270 top
U8  15.88,97.16 0 top
Y1  25.99,102.35 90 top

### Tracks (layer width: path | path; a pad name or v marks a point on that pad's centre or on a via)
+3V  (via drill 0.35)
  Top 0.152: U1.2 15.62,108.97 15.53,108.9 | R10.1 33.07,91.67 R9.1 32.99,91.67 31.77,91.67 R21.2 31.7,91.67 R8.1 30.48,91.52 29.87,90.91 24.84,90.91 23.55,92.2 21.57,92.2 20.97,92.39 | R10.1 35.51,91.67 R11.1 | R10.1 | v13.27,55.79 13.31,55.83 13.32,55.83
  Top 0.254: 17.86,90.93 16.88,89.95 L1.2 | L1.2 16.88,90.1 17.71,90.93 | L1.2 16.88,90.63 | 17.86,90.93 18.04,90.93 18.16,90.82 | 17.71,90.93 17.86,90.93 | 16.73,90.93 17.71,90.93 | 17.5,90.16 16.95,90.71 | 16.88,90.63 16.88,90.79 | 16.88,90.63 16.95,90.71 | 16.95,90.71 17.36,90.71 17.7,90.36 | 16.95,90.71 16.88,90.79 | 16.88,90.79 16.73,90.93 | 16.73,90.93 16.62,90.93 | 16.62,90.93 16.62,90.44 16.65,90.42 | U3.5 16.62,90.93 | R18.1 12.11,104.94 12.11,107.15 R17.1 13.86,108.9 15.53,108.9
  Top 0.508: 16.62,89.78 L1.2 17.5,90.16 17.7,90.36 18.16,90.82 19.05,91.71 C7.1 | J4.1 10.77,38.71 9.56,38.71 9.06,39.21 9.06,51.57 13.32,55.83 | v14.49,83.12 17.1,85.74 17.1,88.9 17.16,88.96
  Top 0.813: C7.1 20.44,91.86 20.97,92.39 20.97,93.93 21.66,94.61 U5.5 U5.4 | U5.4 22.62,95.7 20.43,95.7 20.24,95.89 20.24,97.64 19.86,98.03 C11.1 17.99,98.45 U8.4 16.82,99.31 | U5.4 22.75,95.97 23.5,96.72 25.73,96.72 25.85,96.6 26.16,96.92 C4.1 | C4.1 26.66,97.93 MDBT50Q_1.30 MDBT50Q_1.28 26.47,98.73 C4.1 | 16.82,99.31 16.82,100.92 L2.2 16.88,101.78 15.9,102.76 13.71,102.76 13.34,103.13 R18.1 | 16.82,99.31 16.99,99.31
  Top 1.016: C7.1 19.05,90.83 | 19.05,90.83 19.05,90.08 17.93,88.96 17.16,88.96 | 19.05,90.83 17.59,89.37
  Top 1.27: 20.97,92.39 20.97,94.67 21.86,95.56 U5.4 | 22.75,95.97 21.82,95.97 19.76,98.03 C11.1
  Bottom 0.152: 14.46,82.67 14.49,82.7 v14.49,83.12
  Bottom 0.508: v13.27,55.79 14.46,56.98 14.46,82.67 14.46,83.13
+5V  (via drill 0.35)
  Top 0.152: v27.51,106.98 26.59,106.07 25.83,106.07 R20.1 | v26.67,107.97 25.68,107.97 R19.1 25.6,107.97 25.6,110.34 23.85,112.09 19.89,112.09 18.97,111.18 18.67,111.18 R16.1 18.59,111.1 12.04,111.1 10.44,109.5 10.44,105.46 C2.1
  Top 0.813: U2.2 10.7,105.09 C2.1
  Bottom 0.152: v27.51,106.98 27.51,107.14 v26.67,107.97
/RESET  (via drill 0.35)
  Top 0.152: v32.16,97.46 32.16,96.62 MDBT50Q_1.40 | v32.16,88.85 32.16,89.53 31.77,89.92 R21.1 | v13.34,39.01 J4.3
  Bottom 0.152: v32.16,97.46 v32.16,88.85 32.16,88.32 30.25,86.41 30.25,74.07 23.62,67.44 23.62,56.08 13.34,45.8 v13.34,39.01
BTN_FUNC  (via drill 0.35)
  Top 0.152: v31.09,101.35 30.18,102.26 29.34,102.26 MDBT50Q_1.19 | v36.42,92.66 36.42,91.14 36.04,90.75 34.98,90.75 34.29,90.07 R10.2 | v32.08,67.06 32.08,84.58 38.56,91.06 v38.56,93.12
  Bottom 0.152: SW2.2 30.86,66.37 SW2.1 30.94,66.37 31.39,66.37 v32.08,67.06 | v31.09,101.35 37.8,94.64 37.8,94.03 38.25,93.57 38.25,93.12 | 38.25,93.12 38.25,92.96 37.95,92.66 v36.42,92.66 | 38.25,93.12 v38.56,93.12
BTN_MODE  (via drill 0.35)
  Top 0.152: v33.98,97.46 32.38,99.06 29.34,99.06 MDBT50Q_1.27 | v37.64,93.27 37.64,90.6 36.2,89.15 33.68,89.15 33.07,89.76 33.07,89.92 R9.2 32.76,89.7 32.76,88.44 26.01,81.69 19.14,81.69 17.89,80.44 17.89,68.44 v19.28,67.06
  Bottom 0.152: SW3.2 18.06,57.3 18.06,66.37 SW3.1 18.14,66.37 18.59,66.37 v19.28,67.06 | v33.98,97.46 33.98,97.08 37.64,93.42 v37.64,93.27
BTN_ON_OFF  (via drill 0.35)
  Top 0.152: v33.07,97.46 32.23,98.3 29.34,98.3 MDBT50Q_1.29 | v36.27,93.88 36.27,93.73 37.03,92.96 37.03,91.29 35.74,89.99 35.59,89.99 R11.2 | v44.73,69.42 44.73,78.56 38.1,85.19 v38.1,89.61
  Bottom 0.152: SW1.2 43.51,59.66 43.51,68.66 SW1.1 43.59,68.66 43.97,68.66 v44.73,69.42 | v33.07,97.46 33.07,97.08 34.63,95.52 | v36.27,93.88 34.63,95.52 | v38.1,89.61 33.76,93.95 33.76,94.64 34.63,95.52
BTN_ZERO  (via drill 0.35)
  Top 0.152: v30.18,101.35 30.02,101.5 29.34,101.5 MDBT50Q_1.21 | R8.2 v30.48,88.85 | v15.85,68.66 v8.61,68.66
  Bottom 0.152: SW4.2 5.41,59.66 5.41,68.66 SW4.1 5.49,68.66 v8.61,68.66 | v30.18,101.35 30.18,97.16 30.48,96.85 v30.48,88.85 29.95,88.32 29.95,74.22 24.38,68.66 v15.85,68.66
DISPLAY_RESET  (via drill 0.35)  (1 unrouted)
  Top 0.152: v30.79,99.67 30.56,99.9 29.34,99.9 MDBT50Q_1.25 | v31.17,88.24 30.18,88.24 29.26,89.15 29.26,89.92 R12.2 | v31.39,92.75 v33.07,92.75
  Bottom 0.152: 30.79,92.72 30.79,89.46 31.17,89.08 v31.17,88.24 | 30.79,92.72 v30.79,99.67 | J3.1 34.97,86.78 34.97,91.31 33.53,92.76 33.12,92.76 | 30.79,92.72 30.82,92.75 v31.39,92.75
DISPLAY_SWITCH
  Top 0.152: MDBT50Q_1.50 36.96,96.55 36.96,95.94 34.4,93.38 27.93,93.38 27.28,92.73 24.38,92.73 23.47,93.65 22.78,93.65 U5.6
GND  (via drill 0.25, 0.35)  (2 unrouted)
  Top 0.152: 16.07,91.76 16.15,91.75 U3.4 16.08,91.67 16.08,88.54 16.13,88.49 v15.4,87.64 15.21,87.64 12.21,84.64 | 15.12,93.19 14.86,93.19 v14.25,92.58 | v8.61,58.9 8.61,57.3 19.18,57.3 v19.28,57.3 v32.08,57.3 34.37,59.59 v44.73,59.59 | J4.5 14.61,38.2 12.71,36.3 8.05,36.3 | 2.97,17.83 BAT2.1 | MDBT50Q_1.55 39.31,96.85 37.64,98.52 36.23,98.52 36.21,98.55 36.21,102.95 37.84,104.58 37.84,104.61 MDBT50Q_1.2 MDBT50Q_1.1 | v16.64,92.71 16.97,93.04 17.04,93.04 | C7.2 18.53,93.04 17.04,93.04 | 23.58,110.53 C3.1 | C10.2 24.13,100.81 | 23.39,99.03 | U3.13 15.88,91.77 15.88,91.76 | 17.04,93.04 17.14,92.94 | 27.91,94.61 27.91,94.62 v27.03,94.62 U5.2 | v23.39,100.07 23.36,100.05 C4.2 22.41,99.38 v21.47,99.38 | v19.32,80.7 20.48,79.54 v20.48,62.65 | 28.42,96.32 MDBT50Q_1.32 28.42,96.32
  Top 0.254: R15.1 11.22,109.48 11.24,109.5 | 15.12,93.38 U3.11 U3.10 | v23.58,111.48 23.58,110.53
  Top 0.305: 15.08,92.84 15.12,92.89 15.12,93.19 15.12,93.38 | U3.10 15.62,93.25 | 15.88,92.16 15.88,92.01 U3.3 15.88,91.76 16.07,91.76
  Top 0.381: 24.13,100.81 v23.39,100.07 23.39,99.03
  Top 0.508: J4.5 14.61,37.61 15.6,36.62 18.2,36.62 19.18,37.6 19.18,57.3
  Top 0.61: 11.92,97.06 15.79,97.06 15.91,96.94 15.91,95.89 U8.2 | C9.2 26.89,104.9 27.11,105.13 MDBT50Q_1.15 | MDBT50Q_1.32 28.41,95.11 27.91,94.61
  Top 1.27: 10.49,101.93 10.79,102.23 C2.2 10.7,103.19 U2.1 7.83,102.31 C1.2 8.8,101.93 9.97,101.93 | 10.49,101.93 R7.2 | 9.97,101.93 10.49,101.93 | 9.97,101.93 10.71,101.19 11.04,101.19 11.92,100.31 11.92,97.06 11.21,96.35 C5.2 | BAT2.1 5.5,17.8 5.5,30.2 7.9,32.6 7.9,54.64 7.34,55.2 7.34,78.04 9.27,78.04 11.16,79.94 11.16,83.54 12.12,83.54 | v33.25,87.02 26.97,80.74 19.58,80.75
  Bottom 0.152: SW1.3 48.01,68.66 48.01,59.66 SW1.4 47.93,59.59 v44.73,59.59 | SW2.3 35.36,66.37 35.36,57.3 SW2.4 35.28,57.3 v32.08,57.3 | 9.91,63.51 9.91,68.66 SW4.3 | 9.91,63.51 9.91,59.66 SW4.4 9.83,59.59 9.14,58.9 v8.61,58.9 | v19.28,57.3 SW3.4 22.55,57.3 22.55,66.37 SW3.3 22.48,64.66 v20.47,62.65 | v7.44,63.52 9.9,63.52 9.91,63.51 | v19.32,80.7 19.32,80.78
  Bottom 1.27: 17.71,84.65 17.71,82.39 19.32,80.78
  other vias: 25.88,104.91 15.12,92.71 8.7,102.15 11.21,94.43 11.91,98.61 11.21,109.43 24.49,89.81 3.63,91.41 3.61,92.51 3.61,93.7 33.91,103.18 32.81,103.16 31.62,103.16 12.01,86.64 10.9,86.61 9.72,86.62 14.45,86.58 13.26,86.58 18.97,86.67 17.86,86.65 22.89,88.12 21.79,88.09 20.6,88.1 19.18,99.36 20.28,99.39 3.61,94.84 3.58,95.95 3.59,97.13 3.43,98.3 3.4,99.41 3.41,100.59 3.36,101.68 3.33,102.78 3.34,103.97 3.37,105.1 3.35,106.2 3.35,107.39 3.43,108.64 3.4,109.74 3.41,110.93 18.75,108.89 13.09,110.03 19.06,114.59 17.54,113.3 26.96,112.01 9.7,118.07 10.68,111.46 25.26,115.39 29.31,115.89 37.54,111.89 37.69,109.72 37.71,107.18 36.17,100.17 36.18,100.99 36.17,101.89
  pour Bottom: 3.09,91.28 3.09,119.5 3.2,119.61 38.75,119.61 38.75,85.5 40.18,84.07 3.14,84.07 3.14,91.55
  pour Top: 37.47,119.49 37.57,84.18 37.57,82.17 37.59,82.14 3.22,82.14 3.22,119.49
MBAR_ONOFF
  Top 0.152: MDBT50Q_1.16 28.42,104.39 30.33,104.39 34.14,108.2 34.9,108.2 35.51,108.81 35.51,108.97 R1.2
MISO_3V  (via drill 0.35)
  Top 0.152: v34.37,94.26 34.21,94.41 34.21,95.63 MDBT50Q_1.44 | v23.16,103.02 21.11,103.02 17.14,106.98 16.08,106.98 U1.5
  Bottom 0.152: v34.37,94.26 34.37,93.8 36.12,92.05 38.41,92.05 39.17,92.81 39.17,94.41 30.56,103.02 v23.16,103.02
MISO_5V
  Top 0.152: R6.2 29.18,108.97 28.12,108.97 27.28,108.13 27.28,107.67 26.67,107.06 22.02,107.06 U1.16
MOSI_3V  (via drill 0.35)
  Top 0.152: v28.58,94.01 30.23,94.01 31.47,95.25 31.47,95.33 31.77,95.63 MDBT50Q_1.39 | v24.84,92.13 24.08,92.13 v23.39,92.81 | v14.63,107.29 14.94,107.29 15.24,107.59 16.08,107.59 U1.4
  Bottom 0.152: v28.58,94.01 26.72,94.01 v24.84,92.13 | v23.39,92.81 23.39,98.53 v14.63,107.29
MOSI_5V  (via drill 0.35)
  Top 0.152: v28.19,108.13 29.72,108.13 30.02,108.43 30.02,108.51 30.48,108.97 R5.2 | v20.57,108.05 20.88,108.05 21.26,107.67 22.02,107.67 U1.17
  Bottom 0.152: v28.19,108.13 26.67,109.65 22.17,109.65 v20.57,108.05
N$1
  Top 0.152: R7.1 10.13,99.9 8.61,98.37 U6.1
N$2
  Top 0.152: R1.1 35.51,110.72 35.51,110.87 33.15,113.23 30.4,113.23 29.49,114.15 J2.2
N$3
  Top 0.152: R13.2 8.31,94.03 8.31,95.71 8.53,95.94 U6.6
N$4
  Top 0.152: R3.1 32.99,110.72 32.99,110.87 31.24,112.62 29.18,112.62 27.66,114.15 26.75,114.15 J2.3
N$5
  Top 0.152: R2.2 34.29,110.87 32.23,112.93 29.34,112.93 28.12,114.15 28.12,116.97 J2.7
N$6
  Top 0.152: R16.2 20.34,111.1 21.49,111.1 C3.2 22.1,109.73 22.02,109.65 U1.20 U1.19
N$7
  Top 0.152: R5.1 30.48,110.87 28.12,113.23 24.92,113.23 24,114.15 J2.4
N$8
  Top 0.152: R6.1 29.18,110.72 26.14,110.72 23.62,113.23 22.17,113.23 21.26,114.15 J2.5
N$9
  Top 0.152: MDBT50Q_1.17 28.35,103.56 26.06,103.56 Y1.P$1 25.98,103.48 25.91,103.4 24.16,103.4 C9.1
N$10
  Top 0.152: MDBT50Q_1.18 28.35,102.72 27.58,102.72 26.06,101.19 Y1.P$2 25.98,101.19 24.84,102.34 24.16,102.34 C10.1
N$11
  Top 0.152: R4.2 31.7,110.64 31.7,110.49 31.17,109.96 26.44,109.96 23.47,112.93 21.11,112.93 20.27,113.77 20.27,114.61 21.72,116.05 24.38,116.05 25.3,116.97 J2.8
N$12  (via drill 0.35)
  Top 0.152: 26.06,93.65 25.53,93.65 U5.1 | v27.89,92.43 28.42,92.43 29.18,91.67 R12.1
  Top 0.254: 26.06,93.65 26.67,93.65 v26.98,93.34
  Bottom 0.152: 27.81,92.43 v27.89,92.43 | 27.81,88.52 27.81,88.38
  Bottom 0.254: v27.89,92.43 v26.98,93.34 | 27.81,92.43 27.81,88.52 27.81,88.39 | 27.81,88.38 24.84,85.41 24.45,85.01 24.45,79.31 J3.4
N$14  (via drill 0.25)
  other vias: 15.87,92.71
N$15
  Top 1.27: U8.5 14.93,100.92 L2.1 14.64,100.73 14.03,100.73 14.03,98.48
N$16
  Top 1.27: BAT2.2 6.48,34.02 6.48,42.34 6.04,42.78 6.04,53.22 2.61,56.65 2.61,61.96 BAT1.1
N$18
  Top 0.152: L1.1 15.12,89.53
  Top 0.203: U3.2 15.12,91.68
  Top 0.254: 15.12,90.61 15.12,91.28 15.12,91.68 | 15.12,90.46 15.12,90.18 15.12,90.17
  Top 0.508: 14.51,90.66 14.51,88.78 14.59,88.7 15.12,89.23 15.12,89.53 15.12,90.46 | 14.51,90.66 14.92,90.66 15.12,90.46 | 15.12,91.28 14.51,90.66 | 15.12,90.46 15.12,90.61
SCK_3V  (via drill 0.35)
  Top 0.152: v29.18,94.79 30.18,94.79 30.71,95.33 30.71,95.4 30.94,95.63 MDBT50Q_1.37 | v20.57,104.62 16.92,108.28 16.08,108.28 U1.3 | v24.97,99.66 25.44,100.13 v27.36,100.13
  Bottom 0.152: v29.18,94.79 29.18,95.45 v24.97,99.66 | v27.36,100.13 25.07,102.41 22.78,102.41 v20.57,104.62
SCK_5V  (via drill 0.35)
  Top 0.152: v30.56,106.76 30.94,106.76 32.99,108.81 32.99,108.97 R3.2 | v20.57,108.97 21.18,108.36 22.02,108.36 U1.18
  Bottom 0.152: v30.56,106.76 27.36,109.96 21.57,109.96 v20.57,108.97
SCL_3V  (via drill 0.35)
  Top 0.152: 16.08,105.69 15.32,105.69 15.09,105.46 13.34,105.46 R18.2 | v29.87,96.55 30.56,96.55 MDBT50Q_1.36 | 16.08,105.69 17.53,105.69 22.33,100.89 v22.63,100.89 | 16.08,105.69 U1.7
  Bottom 0.152: J3.3 26.67,83.59 26.82,83.74 26.82,86.18 29.87,89.23 v29.87,96.55 29.11,96.55 24.77,100.89 v22.63,100.89
SCL_5V  (via drill 0.35)
  Top 0.152: 22.02,105.77 22.86,105.77 23.09,105.99 24.08,105.99 R20.2 | v27.43,105.99 28.88,105.99 31.7,108.81 31.7,108.97 R4.1 | v20.57,105.99 20.95,105.99 21.18,105.77 22.02,105.77 | 22.02,105.77 U1.14
  Bottom 0.152: v20.57,105.99 v27.43,105.99
SDA_3V  (via drill 0.35)  (1 unrouted)
  Top 0.152: v29.26,97.31 30.71,97.31 31.39,96.62 MDBT50Q_1.38 | v23.24,101.58 22.1,101.58 17.37,106.3 16.08,106.3 U1.6 16.08,106.38 15.32,106.38 15.01,106.68 R17.2 | v26.99,78.65 22.54,78.65 22.5,78.68
  Bottom 0.152: v29.26,97.31 24.99,101.58 v23.24,101.58 22.4,101.58 22.02,101.19 22.02,100.58 24,98.6 24,92.51 23.93,92.43 23.93,85.82 22.48,84.36 22.48,78.68 v22.5,78.66 | J3.2 28.86,78.65 v26.99,78.65 26.93,78.65
SDA_5V  (via drill 0.35)
  Top 0.152: v23.47,109.04 23.85,108.66 23.85,107.97 R19.2 | v20.57,107.06 21.26,106.38 22.02,106.38 U1.15 | v29.64,105.84 31.24,105.84 33.83,108.43 33.83,108.51 34.29,108.97 R2.1
  Bottom 0.152: v20.57,107.06 21.49,107.06 v23.47,109.04 23.47,108.97 26.59,108.97 27.28,108.28 27.28,108.13 27.89,107.52 27.96,107.52 v29.64,105.84
SWCLK  (via drill 0.35)
  Top 0.152: v15.85,44.12 15.85,43.81 13.34,41.3 J4.4 | 38.24,95.65 MDBT50Q_1.53 39.37,94.52 39.37,94.02 41,92.39 v41,83.63
  Bottom 0.152: v15.85,44.12 15.85,44.82 27.15,56.13 27.15,65.1 41,78.95 v41,83.63
SWDIO  (via drill 0.35)
  Top 0.152: J4.2 12.06,42.67 v14.56,45.16 | MDBT50Q_1.51 37.78,95.31 37.78,95.18 39.53,93.43 v39.53,85.16
  Bottom 0.152: v14.56,45.16 24.9,55.51 24.91,55.51 24.91,64.28 39.53,78.91 v39.53,85.16
V+
  Top 0.152: U3.1 14.63,91.75 14.48,91.76 | 14.55,93.65 14.4,93.64 | 14.43,95.69 14.86,95.78 U8.1 | 14.62,94.46 U3.12 13.21,93.66
  Top 0.203: 14.62,94.46 14.63,94.46 16.02,94.46 16.08,94.41 16.12,94.36 U3.9 U3.8
  Top 0.254: 16.08,94.41 16.82,95.15 U8.3
  Top 0.508: 13.21,93.66 14.4,93.64 14.4,93.68 | 12.91,91.7 12.98,91.76 14.48,91.76
  Top 0.61: R13.1 6.55,95.87 U6.4
  Top 1.016: 12.91,93.37 13.21,93.66 13.77,94.22 14.09,94.22 14.09,95.53 14.25,95.69 14.43,95.69 14.24,95.89 C6.1
  Top 1.27: BAT1.2 2.95,82.96 4.52,84.53 4.54,84.53 8.57,88.56 U4.2 | U4.2 8.57,90.47 7.62,91.42 U4.3 7.62,92.06 6.55,93.13 R13.1 | U4.2 12.43,89.74 12.91,90.22 12.91,91.7 C5.1 12.91,93.37 12.94,93.39 | 13.36,93.39 12.94,93.39 | 12.94,93.39 12.94,95.18 12.98,95.23
V_MEASURE
  Top 0.152: MDBT50Q_1.14 31.85,105 32.16,105.31 32.16,105.39 34.67,107.9 35.89,107.9 36.35,108.36 36.35,111.4 31.7,116.05 30.4,116.05 28.42,118.03 20.8,118.03 14.17,111.4 11.89,111.4 9.6,109.12 9.6,107.97 R15.2
  Top 0.203: R14.1 R15.2
V_SENSOR  (via drill 0.35)
  Top 0.152: 6.13,98.37 6.63,98.37 U6.3 6.71,98.37 7.62,98.37 U6.2 | v33.15,115.52 33.15,116.05 30.86,118.34 20.65,118.34 15.24,112.93 10.9,112.93 6.1,108.13 R14.2
  Top 0.813: 6.2,97.94 6.13,98.01 6.13,98.37 C1.1 6.13,103.75 | 6.13,103.75 U2.3 | R14.2 5.71,104.17 6.13,103.75
  Bottom 0.152: v33.15,115.52 32.77,115.14 32.77,115.06 32.23,114.53 32.23,114.22 J2.1
VHI_SWITCH
  Top 0.152: U6.5 7.62,96.47 7.09,97 6.17,97 4.95,98.22 4.95,108.58 5.11,108.74 5.79,108.74 10.67,113.61 10.67,115.82 13.49,118.64 31.01,118.64 36.65,113 36.65,104.47 35.66,103.48 35.28,103.48 32.54,100.74 29.34,100.74 MDBT50Q_1.23